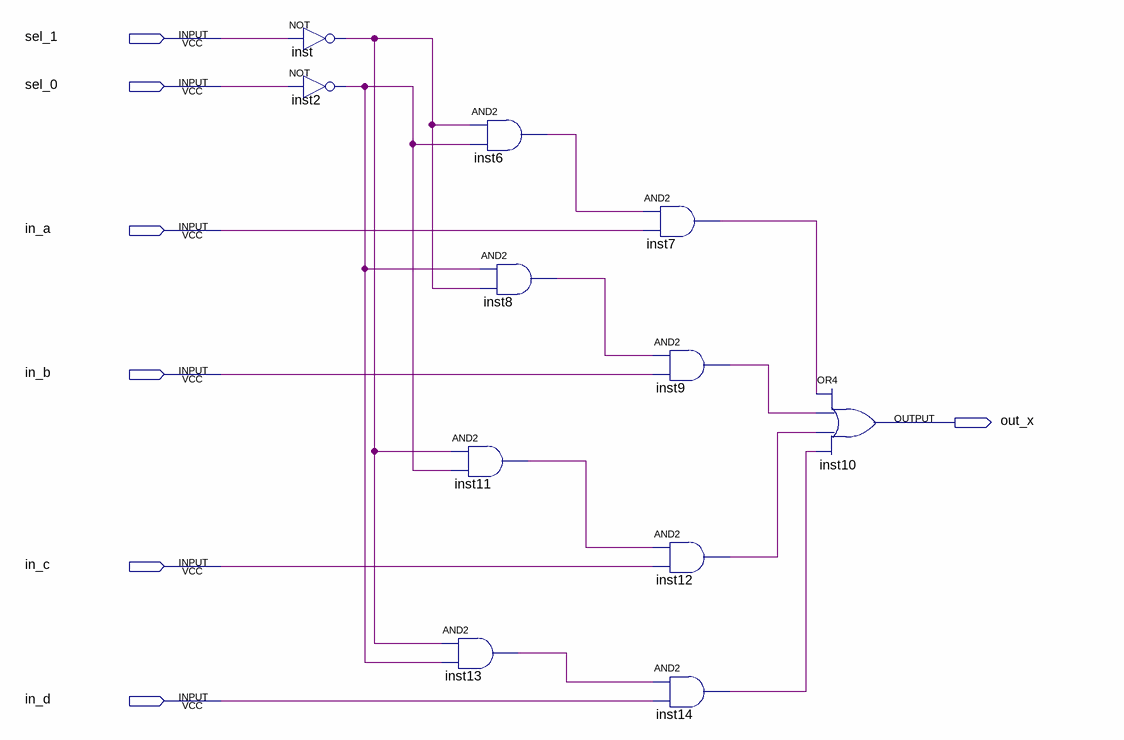
[diagram p0: schematic sheet]
// Quartus schematic Multiplexador.bdf as structural Verilog: 11 symbols, 7 pins
module Multiplexador (
  input  sel_1,
  input  sel_0,
  input  in_a,
  input  in_b,
  input  in_c,
  input  in_d,
  output out_x
);

  wire inst2_out, inst6_out, inst7_out, inst8_out, inst9_out, inst11_out, inst12_out, inst13_out, inst14_out,
       inst_out;

  not inst (inst_out, sel_1);
  not inst2 (inst2_out, sel_0);
  and inst6 (inst6_out, inst_out, inst2_out);
  and inst8 (inst8_out, inst2_out, inst_out);
  and inst11 (inst11_out, inst_out, inst2_out);
  and inst13 (inst13_out, inst_out, inst2_out);
  and inst7 (inst7_out, inst6_out, in_a);
  and inst9 (inst9_out, inst8_out, in_b);
  and inst12 (inst12_out, inst11_out, in_c);
  and inst14 (inst14_out, inst13_out, in_d);
  or inst10 (out_x, inst7_out, inst9_out, inst12_out, inst14_out);
endmodule
